# Altium schematic sheet misc.schdoc: MISC
size A4; Date: 10.26.2025; CheckedBy: BCY; DrawnBy: miaow; DocumentNumber: 14; Revision: v1.0.0; SheetNumber: 14; SheetTotal: 14; BoardType: MAIN_PCB; Desc: Holes & marks
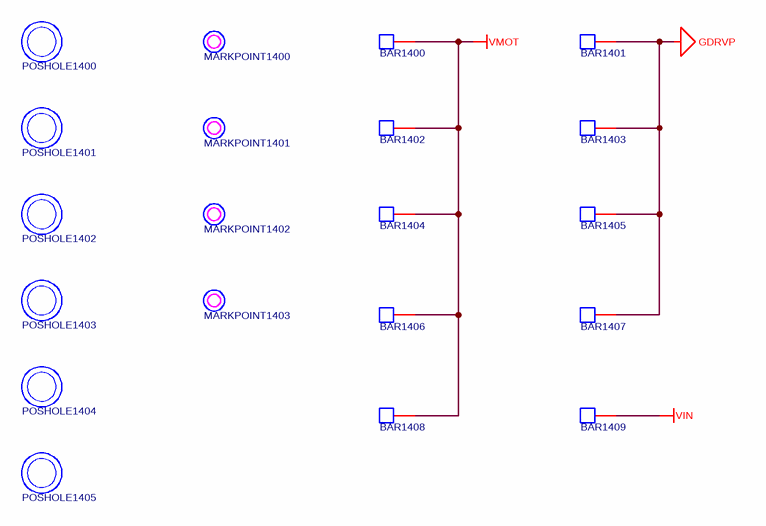
[diagram p0: misc.schdoc]

## Parts
BAR1400  BAR  [BAR3X20T1]  (value not drawn)
BAR1401  BAR  [BAR3X18T1]  (value not drawn)
BAR1402  BAR  [BAR3X8T1]  (value not drawn)
BAR1403  BAR  [BAR3X10T1]  (value not drawn)
BAR1404  BAR  [BAR3X8T1]  (value not drawn)
BAR1405  BAR  [BAR3X10T1]  (value not drawn)
BAR1406  BAR  [BAR3X6T1]  (value not drawn)
BAR1407  BAR  [BAR3X20T1]  (value not drawn)
BAR1408  BAR  [BAR3X18T1]  (value not drawn)
BAR1409  BAR  [BAR3X10T1]  (value not drawn)
MARKPOINT1400  MARKPOINT  [MARKPOINT-1.0]  (value not drawn)
MARKPOINT1401  MARKPOINT  [MARKPOINT-1.0]  (value not drawn)
MARKPOINT1402  MARKPOINT  [MARKPOINT-1.0]  (value not drawn)
MARKPOINT1403  MARKPOINT  [MARKPOINT-1.0]  (value not drawn)
POSHOLE1400  POSHOLE  [POSHOLE-3.2]  (value not drawn)
POSHOLE1401  POSHOLE  [POSHOLE-3.2]  (value not drawn)
POSHOLE1402  POSHOLE  [POSHOLE-3.2]  (value not drawn)
POSHOLE1403  POSHOLE  [POSHOLE-3.2]  (value not drawn)
POSHOLE1404  POSHOLE  [POSHOLE-3.2]  (value not drawn)
POSHOLE1405  POSHOLE  [POSHOLE-3.2]  (value not drawn)

## Nets
GDRVP: BAR1401.1 BAR1403.1 BAR1405.1 BAR1407.1
VIN: BAR1409.1
VMOT: BAR1400.1 BAR1402.1 BAR1404.1 BAR1406.1 BAR1408.1

## Notes on the sheet
- DRAWN
- CHECKED
- DRAWNBY
- SHEETS
- SHEETS_NO

## Library data of the parts
BAR1400-BAR1409 = BAR: SMD copper bar for current reinforcement